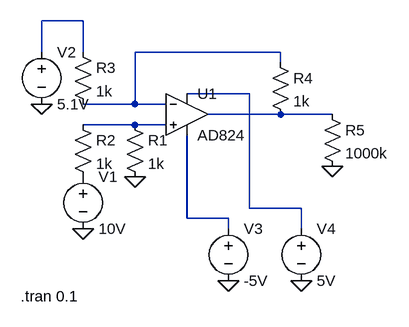
[diagram p0: schematic Draft3.asc]
Draft3.asc, the LTspice schematic file:
Version 4.1
SHEET 1 880 680
WIRE 48 16 -16 16
WIRE -16 64 -16 16
WIRE 48 64 48 16
WIRE 352 64 128 64
WIRE 352 80 352 64
WIRE 304 128 208 128
WIRE 128 144 128 64
WIRE 128 144 48 144
WIRE 176 144 128 144
WIRE 352 160 240 160
WIRE 432 160 352 160
WIRE 128 176 48 176
WIRE 176 176 128 176
WIRE 304 304 304 128
WIRE 384 304 304 304
WIRE 208 320 208 192
WIRE 272 320 208 320
WIRE 272 336 272 320
WIRE 384 336 384 304
FLAG 128 256 0
FLAG 48 336 0
FLAG -16 144 0
FLAG 432 240 0
FLAG 384 416 0
FLAG 272 416 0
SYMBOL OpAmps\\AD824 208 96 R0
SYMATTR InstName U1
SYMBOL res 112 160 R0
SYMATTR InstName R1
SYMATTR Value 1k
SYMBOL res 32 160 R0
SYMATTR InstName R2
SYMATTR Value 1k
SYMBOL voltage 48 240 R0
WINDOW 123 0 0 Left 0
WINDOW 39 0 0 Left 0
SYMATTR InstName V1
SYMATTR Value 10V
SYMBOL res 32 48 R0
SYMATTR InstName R3
SYMATTR Value 1k
SYMBOL voltage -16 48 R0
WINDOW 123 0 0 Left 0
WINDOW 39 0 0 Left 0
SYMATTR InstName V2
SYMATTR Value 5.1V
SYMBOL res 336 64 R0
SYMATTR InstName R4
SYMATTR Value 1k
SYMBOL res 416 144 R0
SYMATTR InstName R5
SYMATTR Value 1000k
SYMBOL voltage 272 320 R0
WINDOW 123 0 0 Left 0
WINDOW 39 0 0 Left 0
SYMATTR InstName V3
SYMATTR Value -5V
SYMBOL voltage 384 320 R0
WINDOW 123 0 0 Left 0
WINDOW 39 0 0 Left 0
SYMATTR InstName V4
SYMATTR Value 5V
TEXT -48 440 Left 2 !.tran 0.1

The netlist it stands for:
* Draft3.asc
X§U1 N005 N002 N003 N006 N004 AD824  ; pins In+ In- V+ V- OUT
R1 N005 0 1k
R2 N005 P001 1k
V1 P001 0 10V
R3 N001 N002 1k
V2 N001 0 5.1V
R4 N002 N004 1k
R5 N004 0 1000k
V3 N006 0 -5V
V4 N003 0 5V
.tran 0.1
.backanno
.end